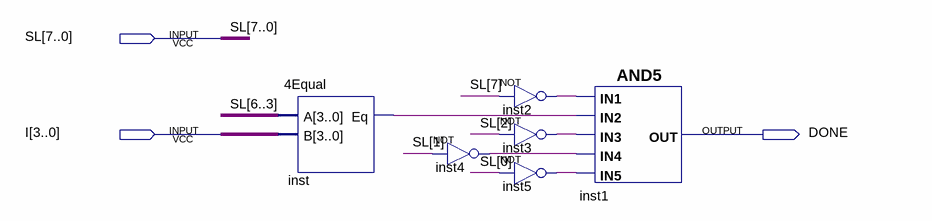
[diagram p0: schematic sheet]
// Quartus schematic DCfSL.bdf as structural Verilog: 6 symbols, 3 pins
module DCfSL (
  input  [7:0] SL,
  input  [3:0] I,
  output DONE
);

  wire inst2_out, inst3_out, inst4_out, inst5_out, inst_eq;

  \4Equal  inst (.A(SL[6:3]), .B(I), .Eq(inst_eq));
  not inst4 (inst4_out, SL[1]);
  not inst2 (inst2_out, SL[7]);
  not inst3 (inst3_out, SL[2]);
  not inst5 (inst5_out, SL[0]);
  and inst1 (DONE, inst2_out, inst_eq, inst3_out, inst4_out, inst5_out);
endmodule
